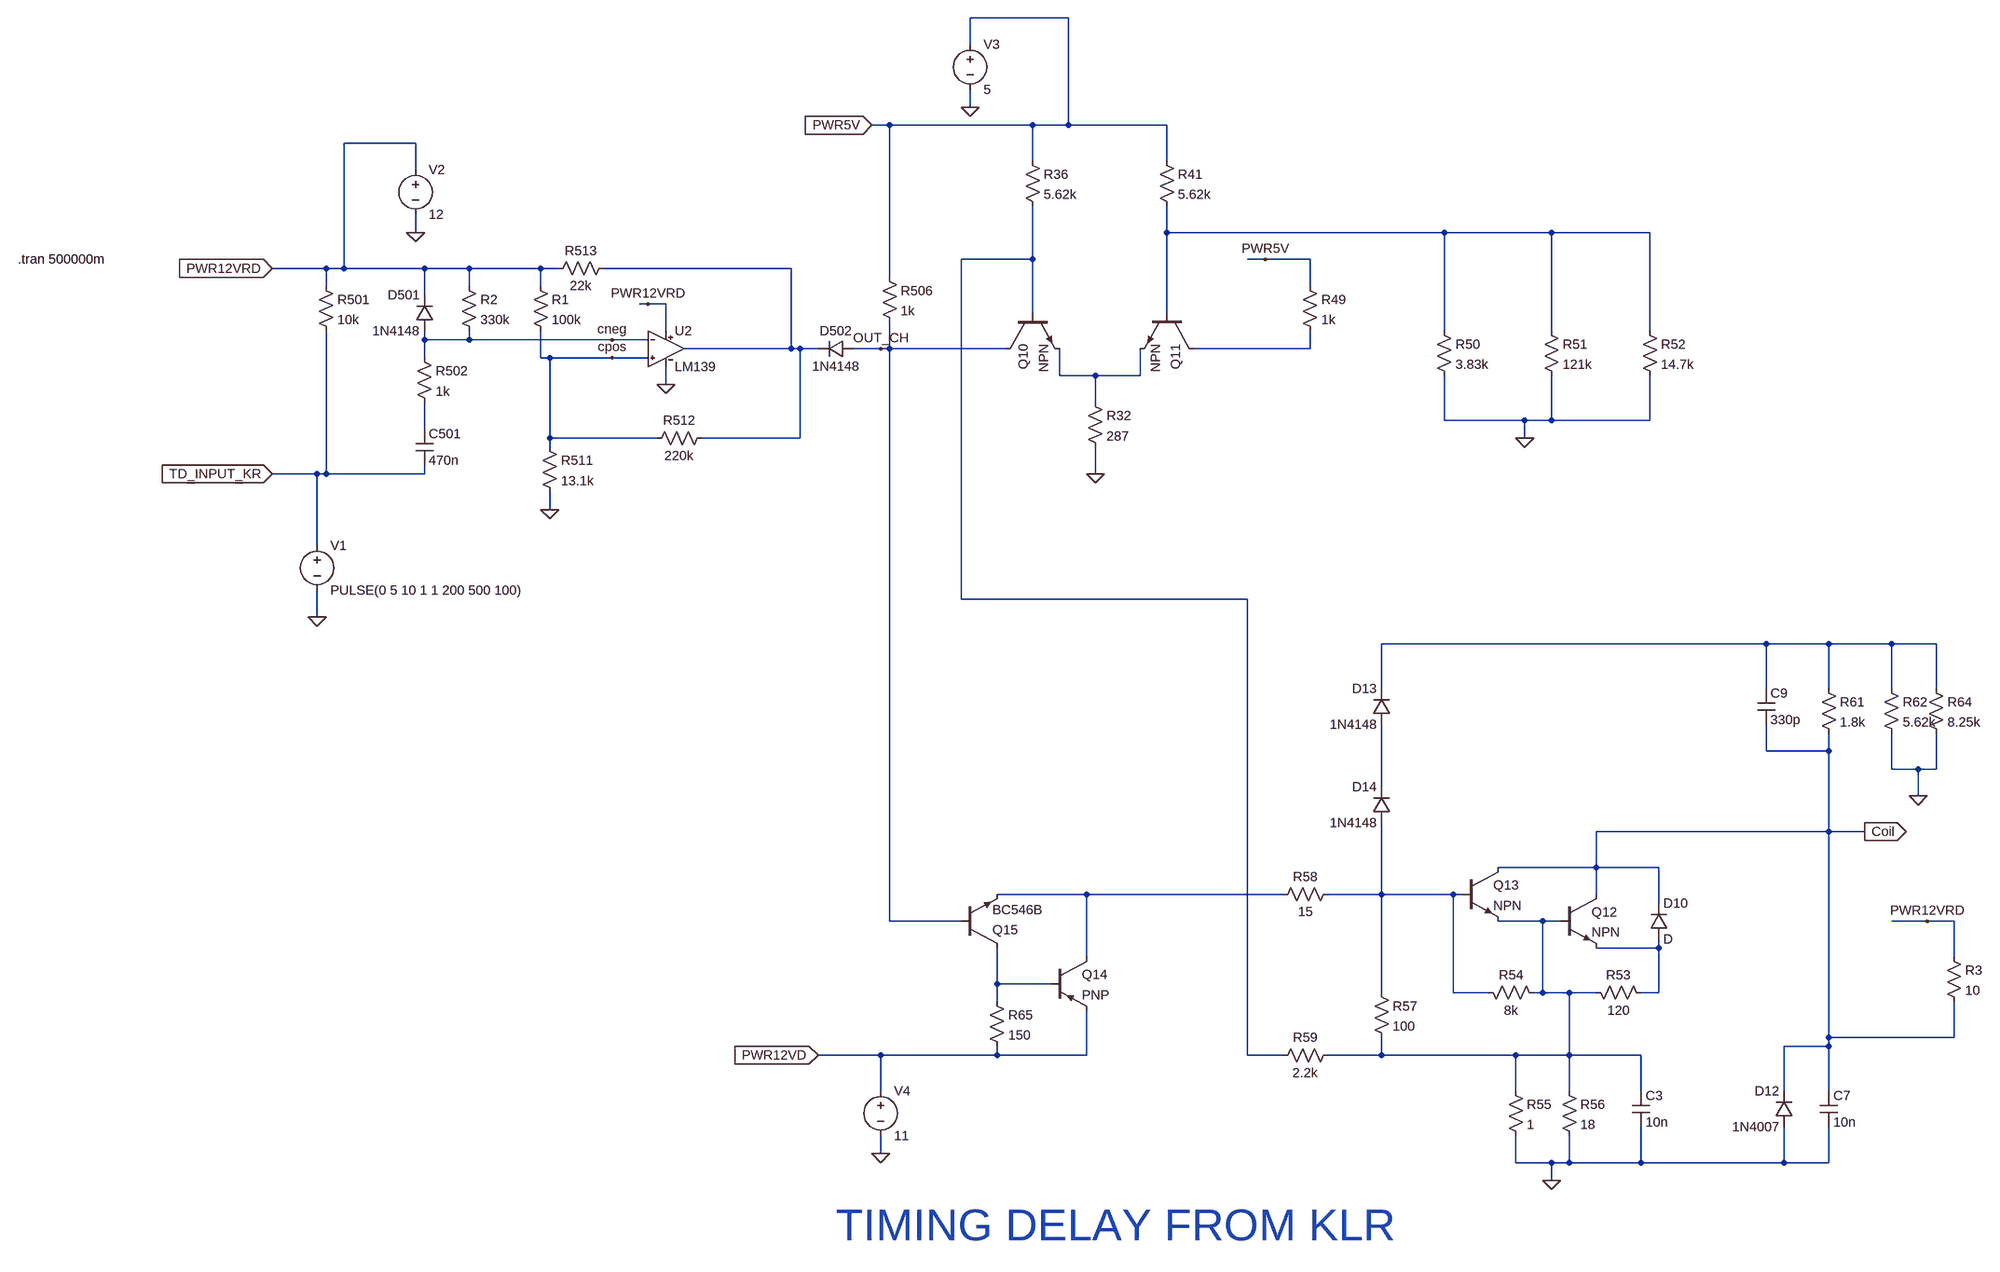
[diagram p0: schematic dme_analog_timing_delay_test.asc]
dme_analog_timing_delay_test.asc, the LTspice schematic file:
Version 4
SHEET 1 4356 3824
WIRE 1200 -368 1024 -368
WIRE 1024 -320 1024 -368
WIRE 1024 -208 1024 -240
WIRE 880 -176 848 -176
WIRE 1136 -176 880 -176
WIRE 1200 -176 1200 -368
WIRE 1200 -176 1136 -176
WIRE 1376 -176 1200 -176
WIRE 32 -144 -96 -144
WIRE 1136 -112 1136 -176
WIRE 1376 -112 1376 -176
WIRE 32 -96 32 -144
WIRE 32 16 32 -16
WIRE 1376 16 1376 -32
WIRE 1872 16 1376 16
WIRE 2064 16 1872 16
WIRE 2240 16 2064 16
WIRE 1136 64 1136 -32
WIRE 1136 64 1008 64
WIRE 1552 64 1520 64
WIRE 1632 64 1552 64
WIRE -128 80 -224 80
WIRE -96 80 -96 -144
WIRE -96 80 -128 80
WIRE 48 80 -96 80
WIRE 128 80 48 80
WIRE 256 80 128 80
WIRE 288 80 256 80
WIRE 704 80 368 80
WIRE 880 96 880 -176
WIRE -128 112 -128 80
WIRE 128 112 128 80
WIRE 256 112 256 80
WIRE 1632 112 1632 64
WIRE 48 128 48 80
WIRE 448 144 432 144
WIRE 480 144 448 144
WIRE 1136 160 1136 64
WIRE 1376 160 1376 16
WIRE 480 192 480 144
WIRE 1872 192 1872 16
WIRE 2064 192 2064 16
WIRE 2240 192 2240 16
WIRE 48 208 48 192
WIRE 128 208 128 192
WIRE 128 208 48 208
WIRE 384 208 128 208
WIRE 448 208 384 208
WIRE 704 224 704 80
WIRE 704 224 512 224
WIRE 720 224 704 224
WIRE 752 224 720 224
WIRE 864 224 816 224
WIRE 880 224 880 176
WIRE 880 224 864 224
WIRE 1088 224 880 224
WIRE 1632 224 1632 192
WIRE 1632 224 1424 224
WIRE 48 240 48 208
WIRE 256 240 256 192
WIRE 272 240 256 240
WIRE 384 240 272 240
WIRE 448 240 384 240
WIRE 1184 272 1184 224
WIRE 1248 272 1184 272
WIRE 1328 272 1328 224
WIRE 1328 272 1248 272
WIRE 480 288 480 256
WIRE 1248 320 1248 272
WIRE 1872 352 1872 272
WIRE 2016 352 1872 352
WIRE 2064 352 2064 272
WIRE 2064 352 2016 352
WIRE 2240 352 2240 272
WIRE 2240 352 2064 352
WIRE 48 368 48 320
WIRE 272 384 272 240
WIRE 464 384 272 384
WIRE 720 384 720 224
WIRE 720 384 544 384
WIRE 2016 384 2016 352
WIRE 272 400 272 384
WIRE -144 448 -224 448
WIRE -128 448 -128 192
WIRE -128 448 -144 448
WIRE 48 448 48 432
WIRE 48 448 -128 448
WIRE 1248 448 1248 400
WIRE 272 512 272 480
WIRE -144 576 -144 448
WIRE 1008 672 1008 64
WIRE 1520 672 1008 672
WIRE -144 704 -144 656
WIRE 2448 752 1760 752
WIRE 2560 752 2448 752
WIRE 2672 752 2560 752
WIRE 2752 752 2672 752
WIRE 1760 832 1760 752
WIRE 2448 832 2448 752
WIRE 2560 832 2560 752
WIRE 2672 832 2672 752
WIRE 2752 832 2752 752
WIRE 2448 944 2448 896
WIRE 2560 944 2560 912
WIRE 2560 944 2448 944
WIRE 2672 976 2672 912
WIRE 2720 976 2672 976
WIRE 2752 976 2752 912
WIRE 2752 976 2720 976
WIRE 1760 1008 1760 896
WIRE 2720 1024 2720 976
WIRE 2560 1088 2560 944
WIRE 2560 1088 2144 1088
WIRE 2624 1088 2560 1088
WIRE 2144 1152 2144 1088
WIRE 2144 1152 1968 1152
WIRE 2256 1152 2144 1152
WIRE 1232 1200 1072 1200
WIRE 1584 1200 1232 1200
WIRE 1760 1200 1760 1072
WIRE 1760 1200 1664 1200
WIRE 1888 1200 1760 1200
WIRE 1904 1200 1888 1200
WIRE 2144 1200 2144 1152
WIRE 2256 1216 2256 1152
WIRE 880 1248 880 224
WIRE 1008 1248 880 1248
WIRE 2048 1248 1968 1248
WIRE 2080 1248 2048 1248
WIRE 2736 1248 2672 1248
WIRE 2784 1248 2736 1248
WIRE 2256 1296 2256 1280
WIRE 2256 1296 2144 1296
WIRE 1232 1312 1232 1200
WIRE 2784 1312 2784 1248
WIRE 1072 1360 1072 1296
WIRE 1168 1360 1072 1360
WIRE 1760 1376 1760 1200
WIRE 1888 1376 1888 1200
WIRE 1952 1376 1888 1376
WIRE 2048 1376 2048 1248
WIRE 2048 1376 2032 1376
WIRE 2096 1376 2048 1376
WIRE 2144 1376 2096 1376
WIRE 2256 1376 2256 1296
WIRE 2256 1376 2224 1376
WIRE 1072 1392 1072 1360
WIRE 2560 1456 2560 1088
WIRE 2784 1456 2784 1392
WIRE 2784 1456 2560 1456
WIRE 2560 1472 2560 1456
WIRE 2560 1472 2480 1472
WIRE 864 1488 752 1488
WIRE 1072 1488 1072 1472
WIRE 1072 1488 864 1488
WIRE 1232 1488 1232 1408
WIRE 1232 1488 1072 1488
WIRE 1520 1488 1520 672
WIRE 1584 1488 1520 1488
WIRE 1760 1488 1760 1456
WIRE 1760 1488 1664 1488
WIRE 2000 1488 1760 1488
WIRE 2096 1488 2096 1376
WIRE 2096 1488 2000 1488
WIRE 2224 1488 2096 1488
WIRE 864 1552 864 1488
WIRE 2000 1552 2000 1488
WIRE 2096 1552 2096 1488
WIRE 2224 1552 2224 1488
WIRE 2480 1552 2480 1472
WIRE 2560 1552 2560 1472
WIRE 864 1664 864 1632
WIRE 2000 1680 2000 1632
WIRE 2064 1680 2000 1680
WIRE 2096 1680 2096 1632
WIRE 2096 1680 2064 1680
WIRE 2224 1680 2224 1616
WIRE 2224 1680 2096 1680
WIRE 2480 1680 2480 1616
WIRE 2480 1680 2224 1680
WIRE 2560 1680 2560 1616
WIRE 2560 1680 2480 1680
WIRE 2064 1712 2064 1680
FLAG 848 -176 PWR5V
IOPIN 848 -176 In
FLAG 272 512 0
FLAG -224 80 PWR12VRD
IOPIN -224 80 In
FLAG 864 224 OUT_CH
FLAG -224 448 TD_INPUT_KR
IOPIN -224 448 In
FLAG 2016 384 0
FLAG 1552 64 PWR5V
FLAG 1248 448 0
FLAG 2064 1712 0
FLAG 2624 1088 Coil
IOPIN 2624 1088 Out
FLAG 2720 1024 0
FLAG 448 144 PWR12VRD
FLAG 480 288 0
FLAG 752 1488 PWR12VD
IOPIN 752 1488 In
FLAG 1024 -208 0
FLAG -144 704 0
FLAG 864 1664 0
FLAG 32 16 0
FLAG 384 208 cneg
FLAG 384 240 cpos
FLAG 2736 1248 PWR12VRD
SYMBOL res -144 96 R0
SYMATTR InstName R501
SYMATTR Value 10k
SYMBOL res 32 224 R0
SYMATTR InstName R502
SYMATTR Value 1k
SYMBOL cap 32 368 R0
SYMATTR InstName C501
SYMATTR Value 470n
SYMBOL diode 64 192 R180
WINDOW 0 24 64 Left 2
WINDOW 3 24 0 Left 2
SYMATTR InstName D501
SYMATTR Value 1N4148
SYMBOL res 384 64 R90
WINDOW 0 0 56 VBottom 2
WINDOW 3 32 56 VTop 2
SYMATTR InstName R513
SYMATTR Value 22k
SYMBOL res 560 368 R90
WINDOW 0 0 56 VBottom 2
WINDOW 3 32 56 VTop 2
SYMATTR InstName R512
SYMATTR Value 220k
SYMBOL res 256 384 R0
SYMATTR InstName R511
SYMATTR Value 13.1k
SYMBOL diode 816 208 R90
WINDOW 0 0 32 VBottom 2
WINDOW 3 32 32 VTop 2
SYMATTR InstName D502
SYMATTR Value 1N4148
SYMBOL res 864 80 R0
SYMATTR InstName R506
SYMATTR Value 1k
SYMBOL Res 240 96 R0
SYMATTR InstName R1
SYMATTR Value 100k
SYMBOL Res 112 96 R0
SYMATTR InstName R2
SYMATTR Value 330k
SYMBOL npn 1088 160 M90
SYMATTR InstName Q10
SYMBOL npn 1424 160 R90
SYMATTR InstName Q11
SYMBOL Res 1232 304 R0
SYMATTR InstName R32
SYMATTR Value 287
SYMBOL Res 1120 -128 R0
SYMATTR InstName R36
SYMATTR Value 5.62k
SYMBOL Res 1360 -128 R0
SYMATTR InstName R41
SYMATTR Value 5.62k
SYMBOL Res 1616 96 R0
SYMATTR InstName R49
SYMATTR Value 1k
SYMBOL Res 1856 176 R0
SYMATTR InstName R50
SYMATTR Value 3.83k
SYMBOL Res 2048 176 R0
SYMATTR InstName R51
SYMATTR Value 121k
SYMBOL Res 2224 176 R0
SYMATTR InstName R52
SYMATTR Value 14.7k
SYMBOL npn 2080 1200 R0
SYMATTR InstName Q12
SYMBOL npn 1904 1152 R0
SYMATTR InstName Q13
SYMBOL diode 2240 1280 M180
WINDOW 0 24 64 Left 2
WINDOW 3 24 0 Left 2
SYMATTR InstName D10
SYMBOL Res 2128 1360 M90
WINDOW 0 0 56 VBottom 2
WINDOW 3 32 56 VTop 2
SYMATTR InstName R53
SYMATTR Value 120
SYMBOL Res 2048 1392 M270
WINDOW 0 32 56 VTop 2
WINDOW 3 0 56 VBottom 2
SYMATTR InstName R54
SYMATTR Value 8k
SYMBOL Res 1984 1536 R0
SYMATTR InstName R55
SYMATTR Value 1
SYMBOL Res 2080 1536 R0
SYMATTR InstName R56
SYMATTR Value 18
SYMBOL Res 1744 1360 R0
SYMATTR InstName R57
SYMATTR Value 100
SYMBOL Res 1680 1472 R90
WINDOW 0 0 56 VBottom 2
WINDOW 3 32 56 VTop 2
SYMATTR InstName R59
SYMATTR Value 2.2k
SYMBOL Res 1680 1184 R90
WINDOW 0 0 56 VBottom 2
WINDOW 3 32 56 VTop 2
SYMATTR InstName R58
SYMATTR Value 15
SYMBOL Cap 2208 1552 R0
SYMATTR InstName C3
SYMATTR Value 10n
SYMBOL diode 2496 1616 R180
WINDOW 0 24 64 Left 2
WINDOW 3 24 0 Left 2
SYMATTR InstName D12
SYMATTR Value 1N4007
SYMBOL Cap 2544 1552 R0
SYMATTR InstName C7
SYMATTR Value 10n
SYMBOL Res 2544 816 R0
SYMATTR InstName R61
SYMATTR Value 1.8k
SYMBOL Res 2656 816 R0
SYMATTR InstName R62
SYMATTR Value 5.62k
SYMBOL Res 2736 816 R0
SYMATTR InstName R64
SYMATTR Value 8.25k
SYMBOL Cap 2432 832 R0
SYMATTR InstName C9
SYMATTR Value 330p
SYMBOL diode 1776 896 R180
WINDOW 0 24 64 Left 2
WINDOW 3 24 0 Left 2
SYMATTR InstName D13
SYMATTR Value 1N4148
SYMBOL diode 1776 1072 R180
WINDOW 0 24 64 Left 2
WINDOW 3 24 0 Left 2
SYMATTR InstName D14
SYMATTR Value 1N4148
SYMBOL pnp 1168 1312 R0
SYMATTR InstName Q14
SYMBOL npn 1008 1296 M180
SYMATTR InstName Q15
SYMATTR Value BC546B
SYMBOL Res 1056 1376 R0
SYMATTR InstName R65
SYMATTR Value 150
SYMBOL voltage -144 560 R0
SYMATTR InstName V1
SYMATTR Value PULSE(0 5 10 1 1 200 500 100)
SYMBOL voltage 32 -112 R0
SYMATTR InstName V2
SYMATTR Value 12
SYMBOL voltage 1024 -336 R0
SYMATTR InstName V3
SYMATTR Value 5
SYMBOL voltage 864 1536 R0
SYMATTR InstName V4
SYMATTR Value 11
SYMBOL Res 2768 1296 R0
SYMATTR InstName R3
SYMATTR Value 10
SYMBOL lm139 480 224 R0
SYMATTR InstName U2
TEXT 784 1792 Left 6 ;TIMING DELAY FROM KLR
TEXT -856 64 Left 2 !.tran 500000m

The netlist it stands for:
* dme_analog_timing_delay_test.asc
R501 PWR12VRD TD_INPUT_KR 10k
R502 cneg N006 1k
C501 N006 TD_INPUT_KR 470n
D501 cneg PWR12VRD 1N4148
R513 N003 PWR12VRD 22k
R512 N003 cpos 220k
R511 cpos 0 13.1k
D502 OUT_CH N003 1N4148
R506 PWR5V OUT_CH 1k
R1 PWR12VRD cpos 100k
R2 PWR12VRD cneg 330k
Q10 OUT_CH N002 N005 0 NPN
Q11 N004 N001 N005 0 NPN
R32 N005 0 287
R36 PWR5V N002 5.62k
R41 PWR5V N001 5.62k
R49 PWR5V N004 1k
R50 N001 0 3.83k
R51 N001 0 121k
R52 N001 0 14.7k
Q12 Coil N011 N012 0 NPN
Q13 Coil N010 N011 0 NPN
D10 N012 Coil D
R53 N011 N012 120
R54 N011 N010 8k
R55 N011 0 1
R56 N011 0 18
R57 N010 N011 100
R59 N011 N002 2.2k
R58 N010 N009 15
C3 N011 0 10n
D12 0 Coil 1N4007
C7 Coil 0 10n
R61 N007 Coil 1.8k
R62 N007 0 5.62k
R64 N007 0 8.25k
C9 N007 Coil 330p
D13 N008 N007 1N4148
D14 N010 N008 1N4148
Q14 N009 N013 PWR12VD 0 PNP
Q15 N013 OUT_CH N009 0 BC546B
R65 N013 PWR12VD 150
V1 TD_INPUT_KR 0 PULSE(0 5 10 1 1 200 500 100)
V2 PWR12VRD 0 12
V3 PWR5V 0 5
V4 PWR12VD 0 11
R3 PWR12VRD Coil 10
XU2 cpos cneg PWR12VRD 0 N003 LM139  ; pins In+ In- V+ V- OUT
.model D D
.lib standard.dio
.model NPN NPN
.model PNP PNP
.lib standard.bjt
* TIMING DELAY FROM KLR
.tran 500000m
.lib lm139.cir
.backanno
.end